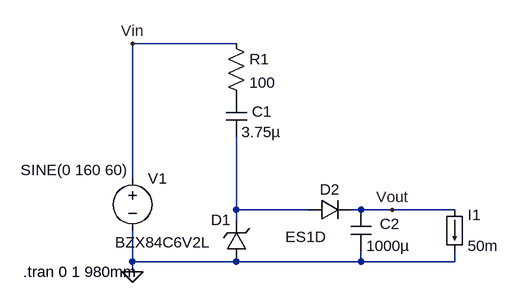
[diagram p0: schematic single.asc]
single.asc, the LTspice schematic file:
Version 4
SHEET 1 880 680
WIRE 160 -96 0 -96
WIRE 0 112 0 -96
WIRE 160 160 160 48
WIRE 272 160 160 160
WIRE 352 160 336 160
WIRE 400 160 352 160
WIRE 496 160 400 160
WIRE 160 176 160 160
WIRE 0 240 0 192
WIRE 160 240 0 240
WIRE 352 240 352 224
WIRE 352 240 160 240
WIRE 496 240 496 224
WIRE 496 240 352 240
WIRE 0 256 0 240
FLAG 0 256 0
FLAG 400 160 Vout
FLAG 0 -96 Vin
SYMBOL res 144 -112 R0
SYMATTR InstName R1
SYMATTR Value 100
SYMBOL cap 144 -16 R0
WINDOW 0 40 25 Left 2
SYMATTR InstName C1
SYMATTR Value 3.75µ
SYMBOL zener 176 240 R180
WINDOW 0 24 64 Left 2
WINDOW 3 56 30 Left 2
SYMATTR InstName D1
SYMATTR Value BZX84C6V2L
SYMBOL cap 336 160 R0
WINDOW 0 45 22 Left 2
SYMATTR InstName C2
SYMATTR Value 1000µ
SYMBOL voltage 0 96 R0
WINDOW 3 -172 3 Left 2
WINDOW 123 0 0 Left 2
WINDOW 39 0 0 Left 2
SYMATTR Value SINE(0 160 60)
SYMATTR InstName V1
SYMBOL diode 272 176 R270
WINDOW 0 32 32 VTop 2
WINDOW 3 -10 -5 VBottom 2
SYMATTR InstName D2
SYMATTR Value ES1D
SYMBOL load 480 160 R0
WINDOW 123 0 0 Left 2
WINDOW 39 0 0 Left 2
SYMATTR InstName I1
SYMATTR Value 50m
TEXT -168 256 Left 2 !.tran 0 1 980mm

The netlist it stands for:
* single.asc
R1 Vin P001 100
C1 P001 N001 3.75µ
D1 0 N001 BZX84C6V2L
C2 Vout 0 1000µ
V1 Vin 0 SINE(0 160 60)
D2 N001 Vout ES1D
I1 Vout 0 50m
.model D D
.lib standard.dio
.tran 0 1 980mm
.backanno
.end